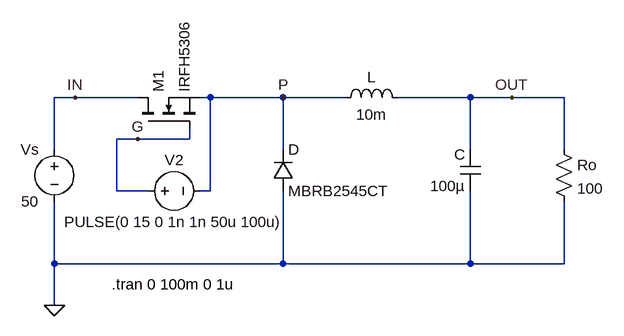
[diagram p0: schematic buck_converter_continuous_conduction_large_L.asc]
buck_converter_continuous_conduction_large_L.asc, the LTspice schematic file:
Version 4.1
SHEET 1 880 680
WIRE -32 112 -64 112
WIRE 64 112 -32 112
WIRE 176 112 160 112
WIRE 288 112 176 112
WIRE 384 112 288 112
WIRE 576 112 464 112
WIRE 640 112 576 112
WIRE 720 112 640 112
WIRE 64 176 32 176
WIRE 144 176 144 160
WIRE 144 176 64 176
WIRE -64 192 -64 112
WIRE 288 192 288 112
WIRE 576 192 576 112
WIRE 720 192 720 112
WIRE 32 256 32 176
WIRE 80 256 32 256
WIRE 176 256 176 112
WIRE 176 256 160 256
WIRE -64 368 -64 272
WIRE 288 368 288 256
WIRE 288 368 -64 368
WIRE 576 368 576 256
WIRE 576 368 288 368
WIRE 720 368 720 272
WIRE 720 368 576 368
WIRE -64 432 -64 368
FLAG -64 432 0
FLAG 640 112 OUT
FLAG -32 112 IN
FLAG 288 112 P
FLAG 64 176 G
SYMBOL voltage -64 176 M0
WINDOW 123 0 0 Left 0
WINDOW 39 0 0 Left 0
SYMATTR InstName Vs
SYMATTR Value 50
SYMBOL nmos 64 160 R270
SYMATTR InstName M1
SYMATTR Value IRFH5306
SYMBOL diode 272 256 M180
WINDOW 0 24 64 Left 2
WINDOW 3 24 0 Left 2
SYMATTR InstName D
SYMATTR Value MBRB2545CT
SYMBOL ind 368 128 R270
WINDOW 0 32 56 VTop 2
WINDOW 3 5 56 VBottom 2
SYMATTR InstName L
SYMATTR Value 10m
SYMBOL cap 592 192 M0
SYMATTR InstName C
SYMATTR Value 100µ
SYMBOL res 704 176 R0
SYMATTR InstName Ro
SYMATTR Value 100
SYMBOL voltage 64 256 R270
WINDOW 0 32 56 VTop 2
WINDOW 3 -32 56 VBottom 2
WINDOW 123 0 0 Left 0
WINDOW 39 0 0 Left 0
SYMATTR InstName V2
SYMATTR Value PULSE(0 15 0 1n 1n 50u 100u)
TEXT 24 400 Left 2 !.tran 0 100m 0 1u

The netlist it stands for:
* buck_converter_continuous_conduction_large_L.asc
Vs IN 0 50
M1 IN G P P IRFH5306
D 0 P MBRB2545CT
L P OUT 10m
C OUT 0 100µ
Ro OUT 0 100
V2 G P PULSE(0 15 0 1n 1n 50u 100u)
.model D D
.lib standard.dio
.model NMOS NMOS
.model PMOS PMOS
.lib standard.mos
.tran 0 100m 0 1u
.backanno
.end